# Altium schematic sheet RFR24 AMS Design - Fuses V1.SchDoc
size A; SheetNumber: 9; SheetTotal: 10
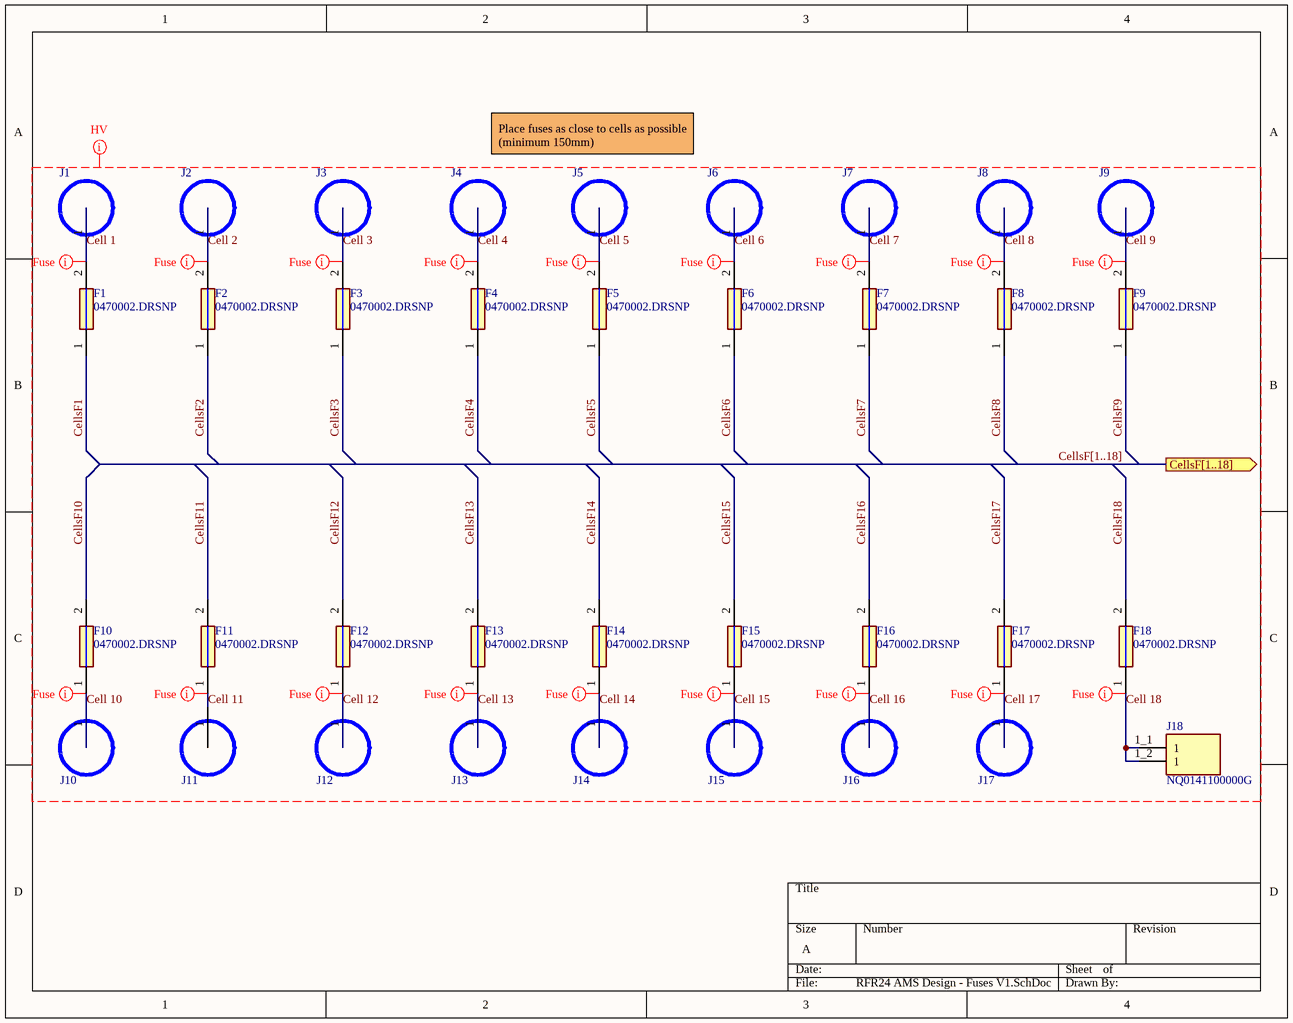
[diagram p0: RFR24 AMS Design - Fuses V1.SchDoc]

## Parts
F1  0470002.DRSNP  [0470002DRSNP]
F2  0470002.DRSNP  [0470002DRSNP]
F3  0470002.DRSNP  [0470002DRSNP]
F4  0470002.DRSNP  [0470002DRSNP]
F5  0470002.DRSNP  [0470002DRSNP]
F6  0470002.DRSNP  [0470002DRSNP]
F7  0470002.DRSNP  [0470002DRSNP]
F8  0470002.DRSNP  [0470002DRSNP]
F9  0470002.DRSNP  [0470002DRSNP]
F10  0470002.DRSNP  [0470002DRSNP]
F11  0470002.DRSNP  [0470002DRSNP]
F12  0470002.DRSNP  [0470002DRSNP]
F13  0470002.DRSNP  [0470002DRSNP]
F14  0470002.DRSNP  [0470002DRSNP]
F15  0470002.DRSNP  [0470002DRSNP]
F16  0470002.DRSNP  [0470002DRSNP]
F17  0470002.DRSNP  [0470002DRSNP]
F18  0470002.DRSNP  [0470002DRSNP]
J1  2900-3-15-20-75-14-11-0  [2900-3-15-20-75-14-11-0-Footprint-1]  (value not drawn)
J2  2900-3-15-20-75-14-11-0  [2900-3-15-20-75-14-11-0-Footprint-1]  (value not drawn)
J3  2900-3-15-20-75-14-11-0  [2900-3-15-20-75-14-11-0-Footprint-1]  (value not drawn)
J4  2900-3-15-20-75-14-11-0  [2900-3-15-20-75-14-11-0-Footprint-1]  (value not drawn)
J5  2900-3-15-20-75-14-11-0  [2900-3-15-20-75-14-11-0-Footprint-1]  (value not drawn)
J6  2900-3-15-20-75-14-11-0  [2900-3-15-20-75-14-11-0-Footprint-1]  (value not drawn)
J7  2900-3-15-20-75-14-11-0  [2900-3-15-20-75-14-11-0-Footprint-1]  (value not drawn)
J8  2900-3-15-20-75-14-11-0  [2900-3-15-20-75-14-11-0-Footprint-1]  (value not drawn)
J9  2900-3-15-20-75-14-11-0  [2900-3-15-20-75-14-11-0-Footprint-1]  (value not drawn)
J10  2900-3-15-20-75-14-11-0  [2900-3-15-20-75-14-11-0-Footprint-1]  (value not drawn)
J11  2900-3-15-20-75-14-11-0  [2900-3-15-20-75-14-11-0-Footprint-1]  (value not drawn)
J12  2900-3-15-20-75-14-11-0  [2900-3-15-20-75-14-11-0-Footprint-1]  (value not drawn)
J13  2900-3-15-20-75-14-11-0  [2900-3-15-20-75-14-11-0-Footprint-1]  (value not drawn)
J14  2900-3-15-20-75-14-11-0  [2900-3-15-20-75-14-11-0-Footprint-1]  (value not drawn)
J15  2900-3-15-20-75-14-11-0  [2900-3-15-20-75-14-11-0-Footprint-1]  (value not drawn)
J16  2900-3-15-20-75-14-11-0  [2900-3-15-20-75-14-11-0-Footprint-1]  (value not drawn)
J17  2900-3-15-20-75-14-11-0  [2900-3-15-20-75-14-11-0-Footprint-1]  (value not drawn)
J18  NQ0141100000G  [AMPHENOL_NQ0141100000G]

## Ports
CellsF[1..18] (out)

## Nets
Cell 1: F1.2 J1.1
Cell 2: F2.2 J2.1
Cell 3: F3.2 J3.1
Cell 4: F4.2 J4.1
Cell 5: F5.2 J5.1
Cell 6: F6.2 J6.1
Cell 7: F7.2 J7.1
Cell 8: F8.2 J8.1
Cell 9: F9.2 J9.1
Cell 10: F10.1 J10.1
Cell 11: F11.1 J11.1
Cell 12: F12.1 J12.1
Cell 13: F13.1 J13.1
Cell 14: F14.1 J14.1
Cell 15: F15.1 J15.1
Cell 16: F16.1 J16.1
Cell 17: F17.1 J17.1
Cell 18: F18.1 J18.1_1(1) J18.1_2(1)
CellsF1: F1.1
CellsF2: F2.1
CellsF3: F3.1
CellsF4: F4.1
CellsF5: F5.1
CellsF6: F6.1
CellsF7: F7.1
CellsF8: F8.1
CellsF9: F9.1
CellsF10: F10.2
CellsF11: F11.2
CellsF12: F12.2
CellsF13: F13.2
CellsF14: F14.2
CellsF15: F15.2
CellsF16: F16.2
CellsF17: F17.2
CellsF18: F18.2

## Buses and harness runs
bus CellsF[1..18] = port CellsF[1..18]

## Layout directives
net class HV; rule Width Constraint [Pref Width = 0.254mm    Min Width = 0.254mm    Max Width = 0.635mm]: Cell 1, Cell 2, Cell 3, Cell 4, Cell 5, Cell 6, Cell 7, Cell 8, Cell 9, Cell 10, Cell 11, Cell 12, Cell 13, Cell 14, Cell 15, Cell 16, Cell 17, Cell 18, CellsF1, CellsF2, CellsF3, CellsF4, CellsF5, CellsF6, CellsF7, CellsF8, CellsF9, CellsF10, CellsF11, CellsF12, CellsF13, CellsF14, CellsF15, CellsF16, CellsF17, CellsF18, CellsF[1..18]
net class Fuse; rule Length Constraint [Min Length = 0mm    Max Length = 150mm]: Cell 1, Cell 2, Cell 3, Cell 4, Cell 5, Cell 6, Cell 7, Cell 8, Cell 9, Cell 10, Cell 11, Cell 12, Cell 13, Cell 14, Cell 15, Cell 16, Cell 17, Cell 18

## Notes on the sheet
- Place fuses as close to cells as possible (minimum 150mm)

## Library data of the parts
F1-F18 = 0470002.DRSNP: Fuse; Manufacturer_Name: LITTELFUSE; Datasheet Link: http://m.littelfuse.com/~/media/electronics/datasheets/fuses/littelfuse_fuse_470_datasheet.pdf.pdf; Height: 1.168mm; Manufacturer_Part_Number: 0470002.DRSNP; Mouser Part Number: 576-0470002.DRSNP; Mouser Price/Stock: https://www.mouser.co.uk/ProductDetail/Littelfuse/0470002DRSNP?qs=gt1LBUVyoHlpmzfh2ZMJjA%3D%3D; Arrow Part Number: 0470002.DRSNP; Arrow Price/Stock: https://www.arrow.com/en/products/0470002.drsnp/littelfuse
J1-J17 = CMP-002-00072-2: https://www.mouser.com/datasheet/2/273/Mil_Max_7_10_2023_2900_3_15_20_75_14_11_0_DSL-3236111.pdf
J18 = NQ0141100000G: 1 Position Wire to Board Terminal Block Horizontal with Board Surface Mount; MF: Amphenol Anytek; Package: None; Check_prices: https://www.snapeda.com/parts/NQ0141100000G/Amphenol/view-part/?ref=eda; Availability: In Stock; Value: *; MP: NQ0141100000G; SnapEDA_Link: https://www.snapeda.com/parts/NQ0141100000G/Amphenol/view-part/?ref=snap; Price: None; Purchase-URL: https://pricing.snapeda.com/search/part/NQ0141100000G/?ref=eda